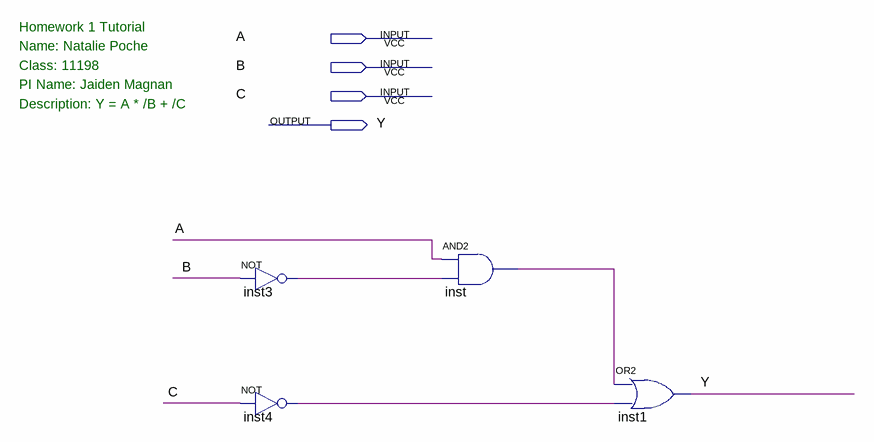
[diagram p0: schematic sheet]
// Quartus schematic hw1_tutorial.bdf as structural Verilog: 4 symbols, 4 pins
module hw1_tutorial (
  input  A,
  input  B,
  input  C,
  output Y
);

  wire inst3_out, inst4_out, inst_out;

  not inst3 (inst3_out, B);
  not inst4 (inst4_out, C);
  and inst (inst_out, A, inst3_out);
  or inst1 (Y, inst_out, inst4_out);

  // Notes on the sheet:
  //   Homework 1 Tutorial
  //   Name: Natalie Poche
  //   Class: 11198
  //   PI Name: Jaiden Magnan
  //   Description: Y = A * /B + /C
endmodule
